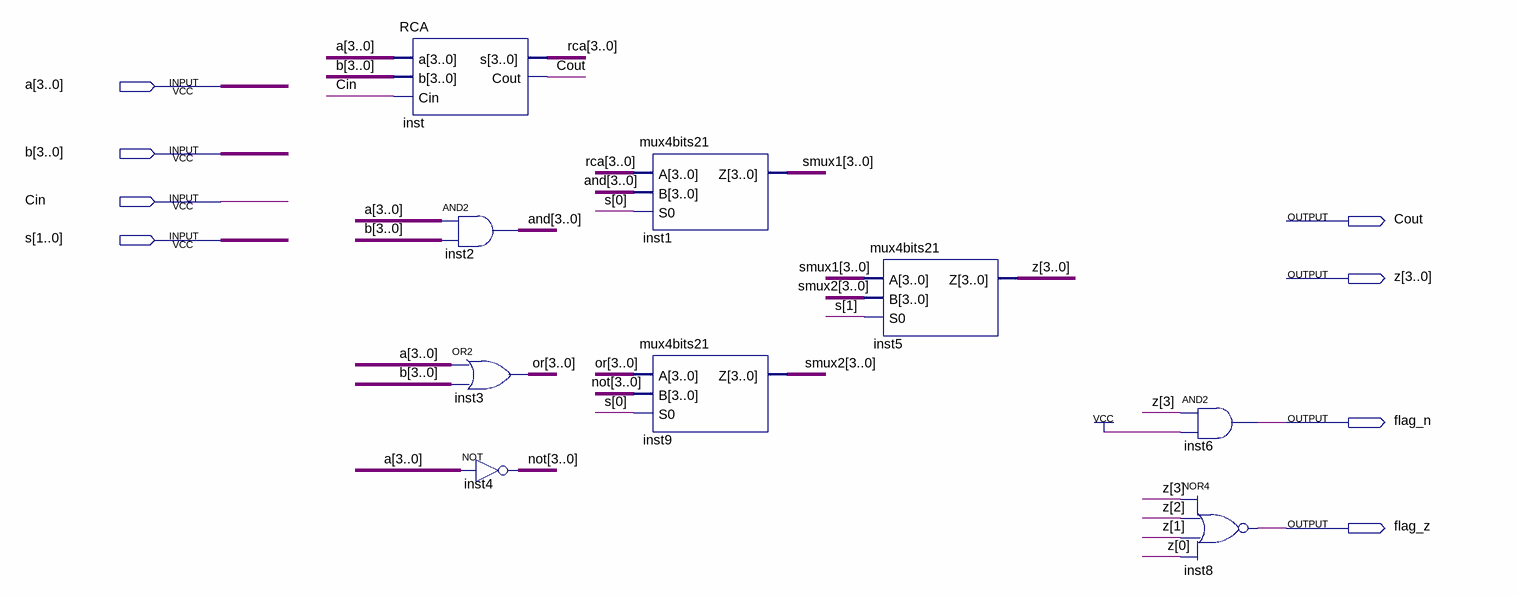
[diagram p0: schematic sheet]
// Quartus schematic ULA.bdf as structural Verilog: 9 symbols, 8 pins
module ULA (
  input  [3:0] a,
  input  [3:0] b,
  input  Cin,
  input  [1:0] s,
  output Cout,
  output [3:0] z,
  output flag_n,
  output flag_z
);

  wire [3:0] \and , \not , \or , rca, smux1, smux2;

  RCA inst (.a(a), .b(b), .Cin(Cin), .s(rca), .Cout(Cout));
  assign \and  = a & b;  // AND2 inst2, 4 bits wide
  assign \or  = a | b;  // OR2 inst3, 4 bits wide
  assign \not  = ~a;  // NOT inst4, 4 bits wide
  mux4bits21 inst1 (.A(rca), .B(\and ), .S0(s[0]), .Z(smux1));
  mux4bits21 inst9 (.A(\or ), .B(\not ), .S0(s[0]), .Z(smux2));
  mux4bits21 inst5 (.A(smux1), .B(smux2), .S0(s[1]), .Z(z));
  and inst6 (flag_n, z[3], 1'b1);
  nor inst8 (flag_z, z[3], z[2], z[1], z[0]);
endmodule
